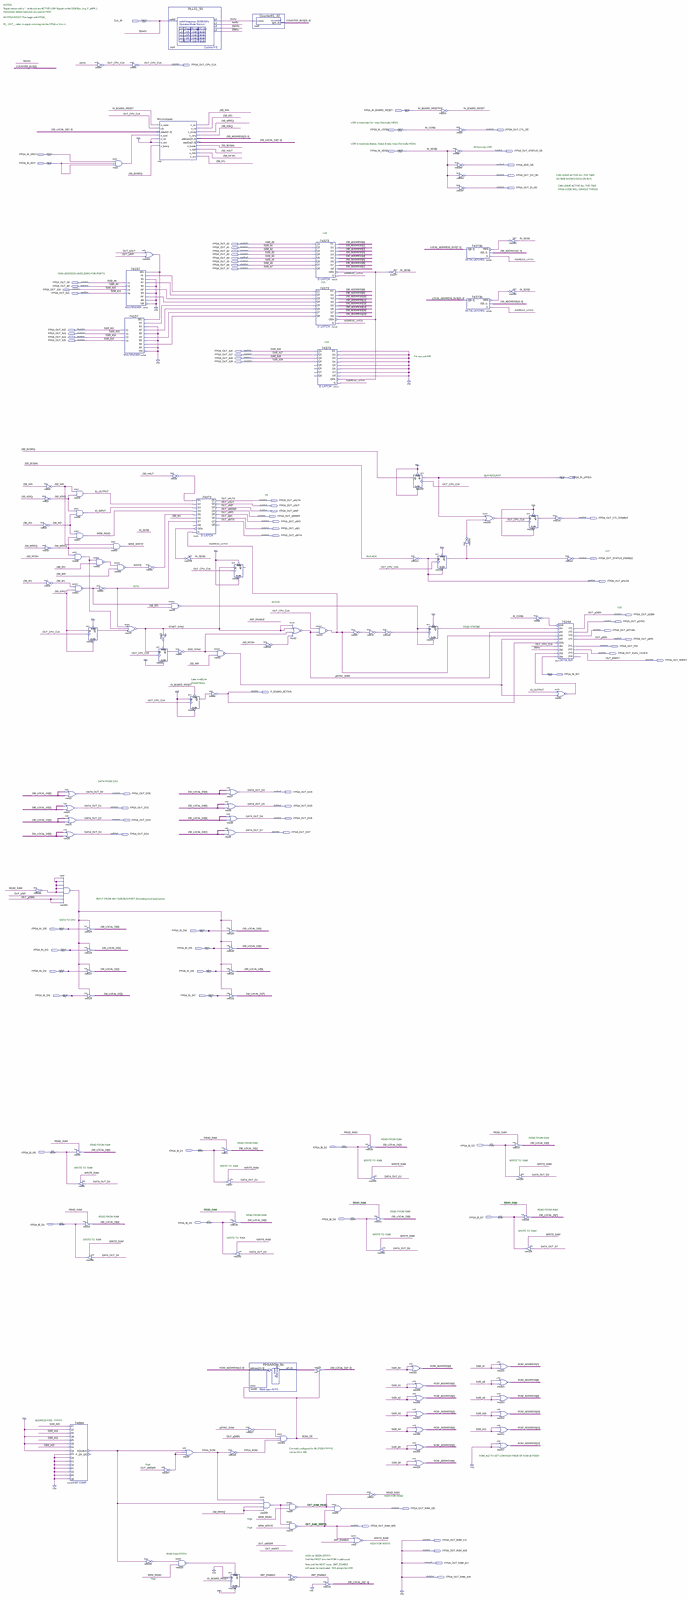
[diagram p0: schematic sheet, whole]
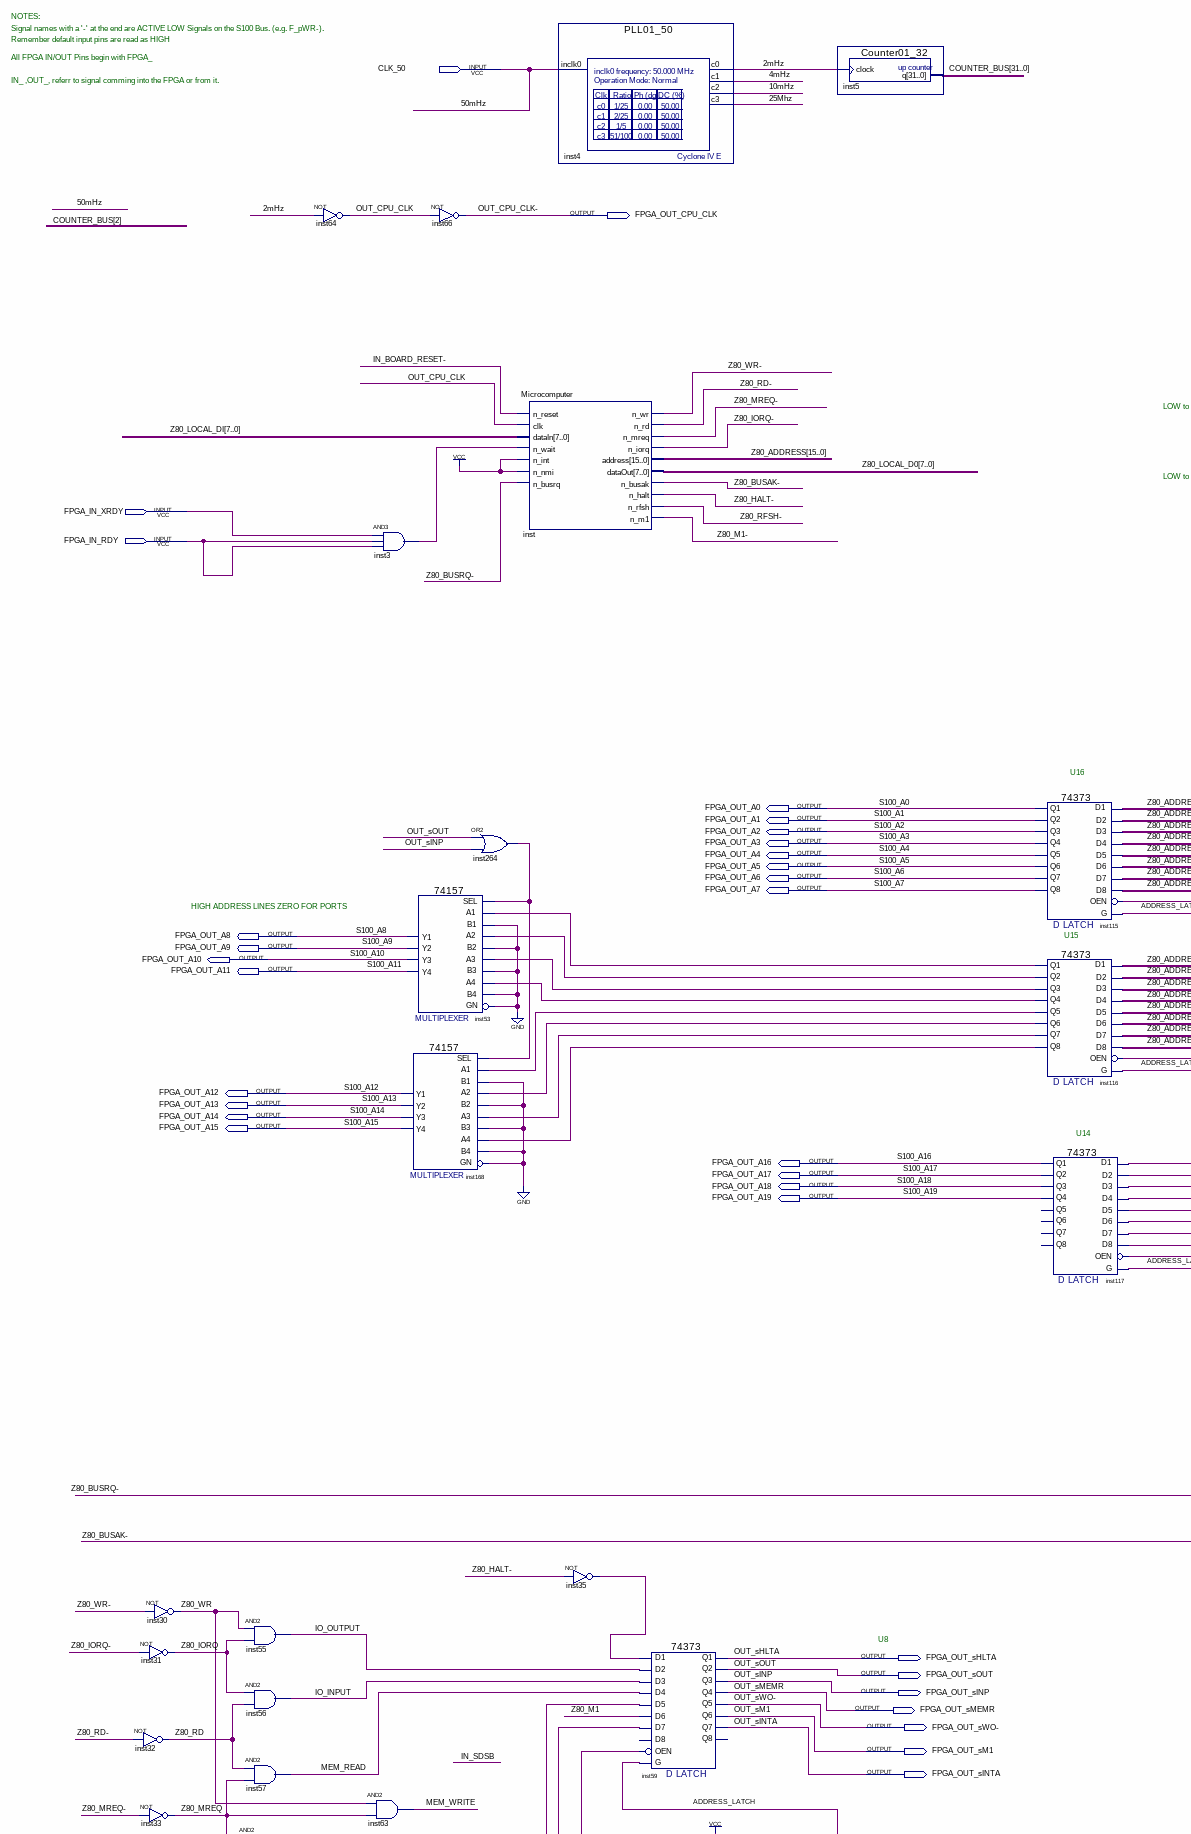
[diagram p1: schematic sheet, upper left part]
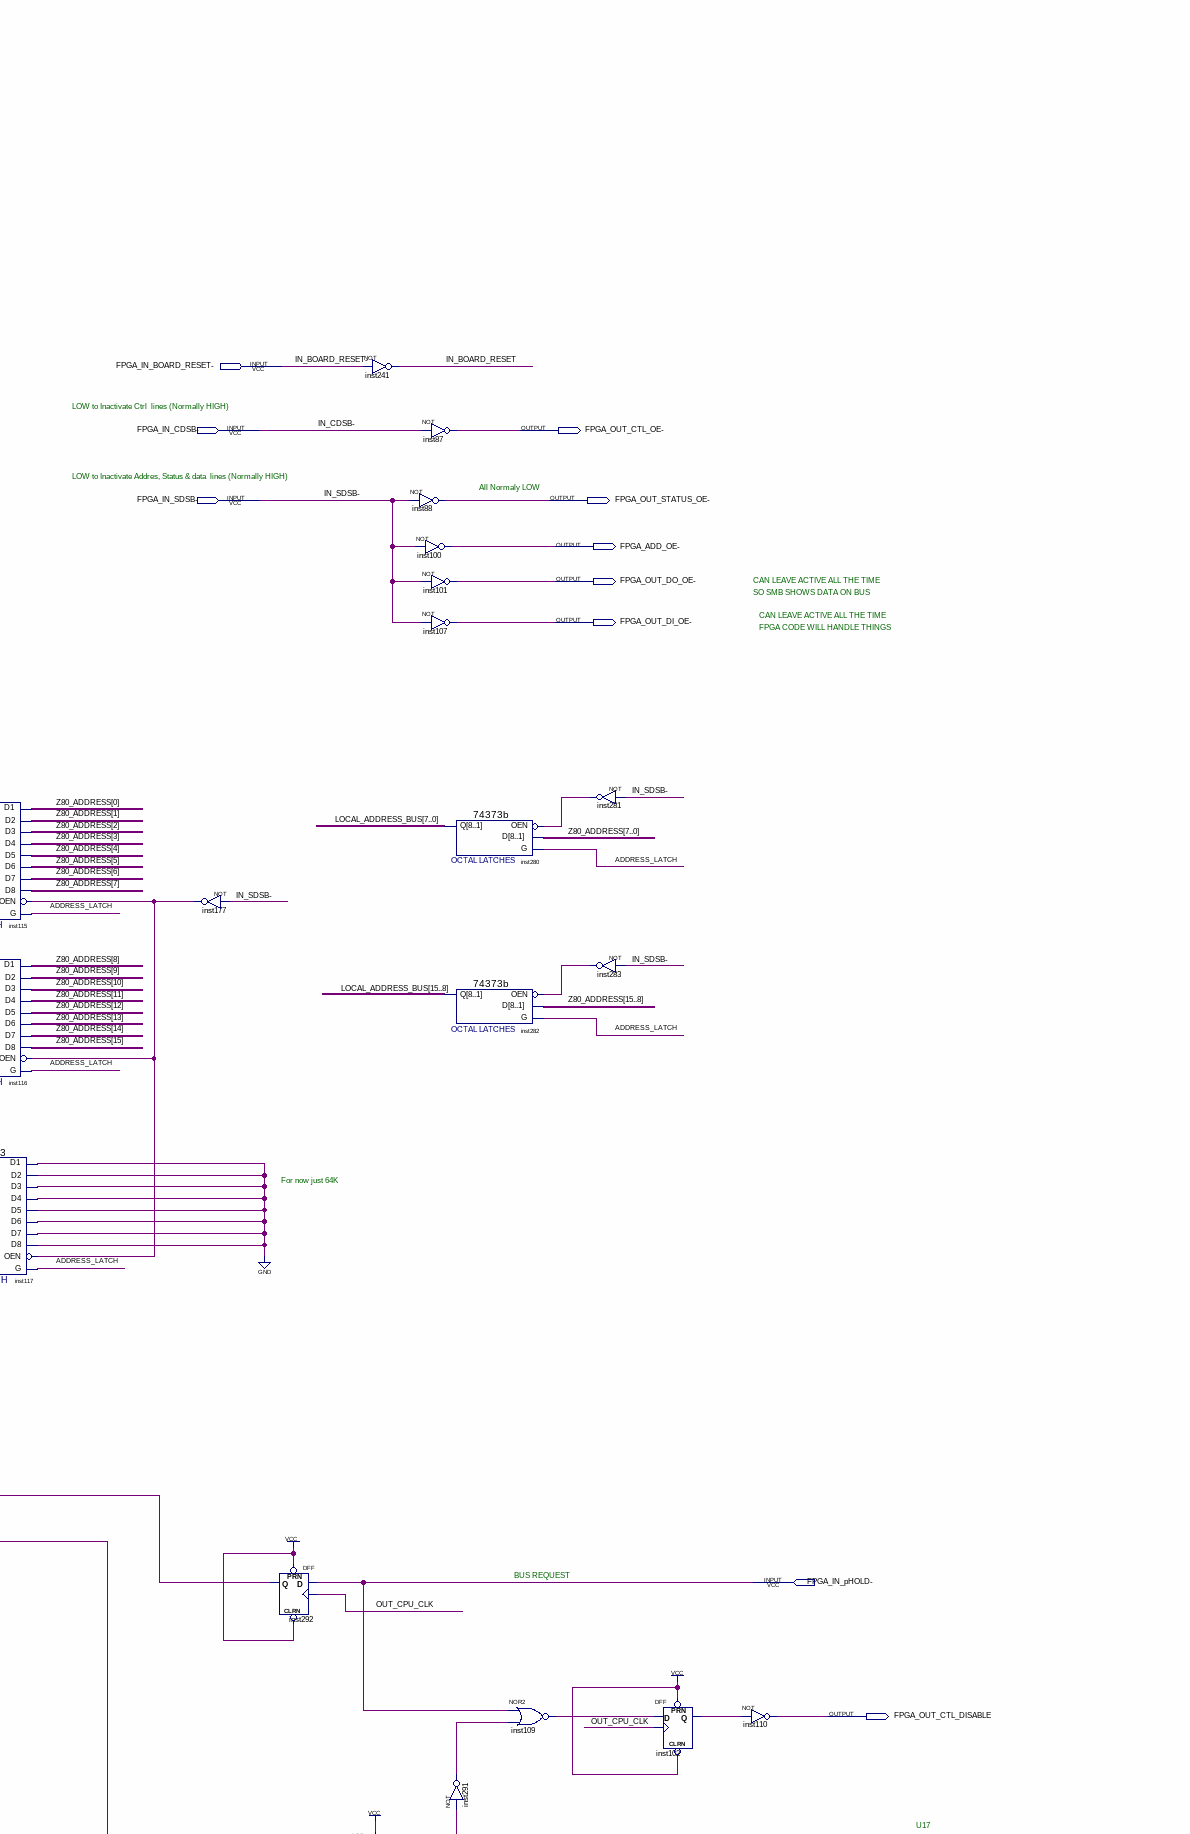
[diagram p2: schematic sheet, upper right part]
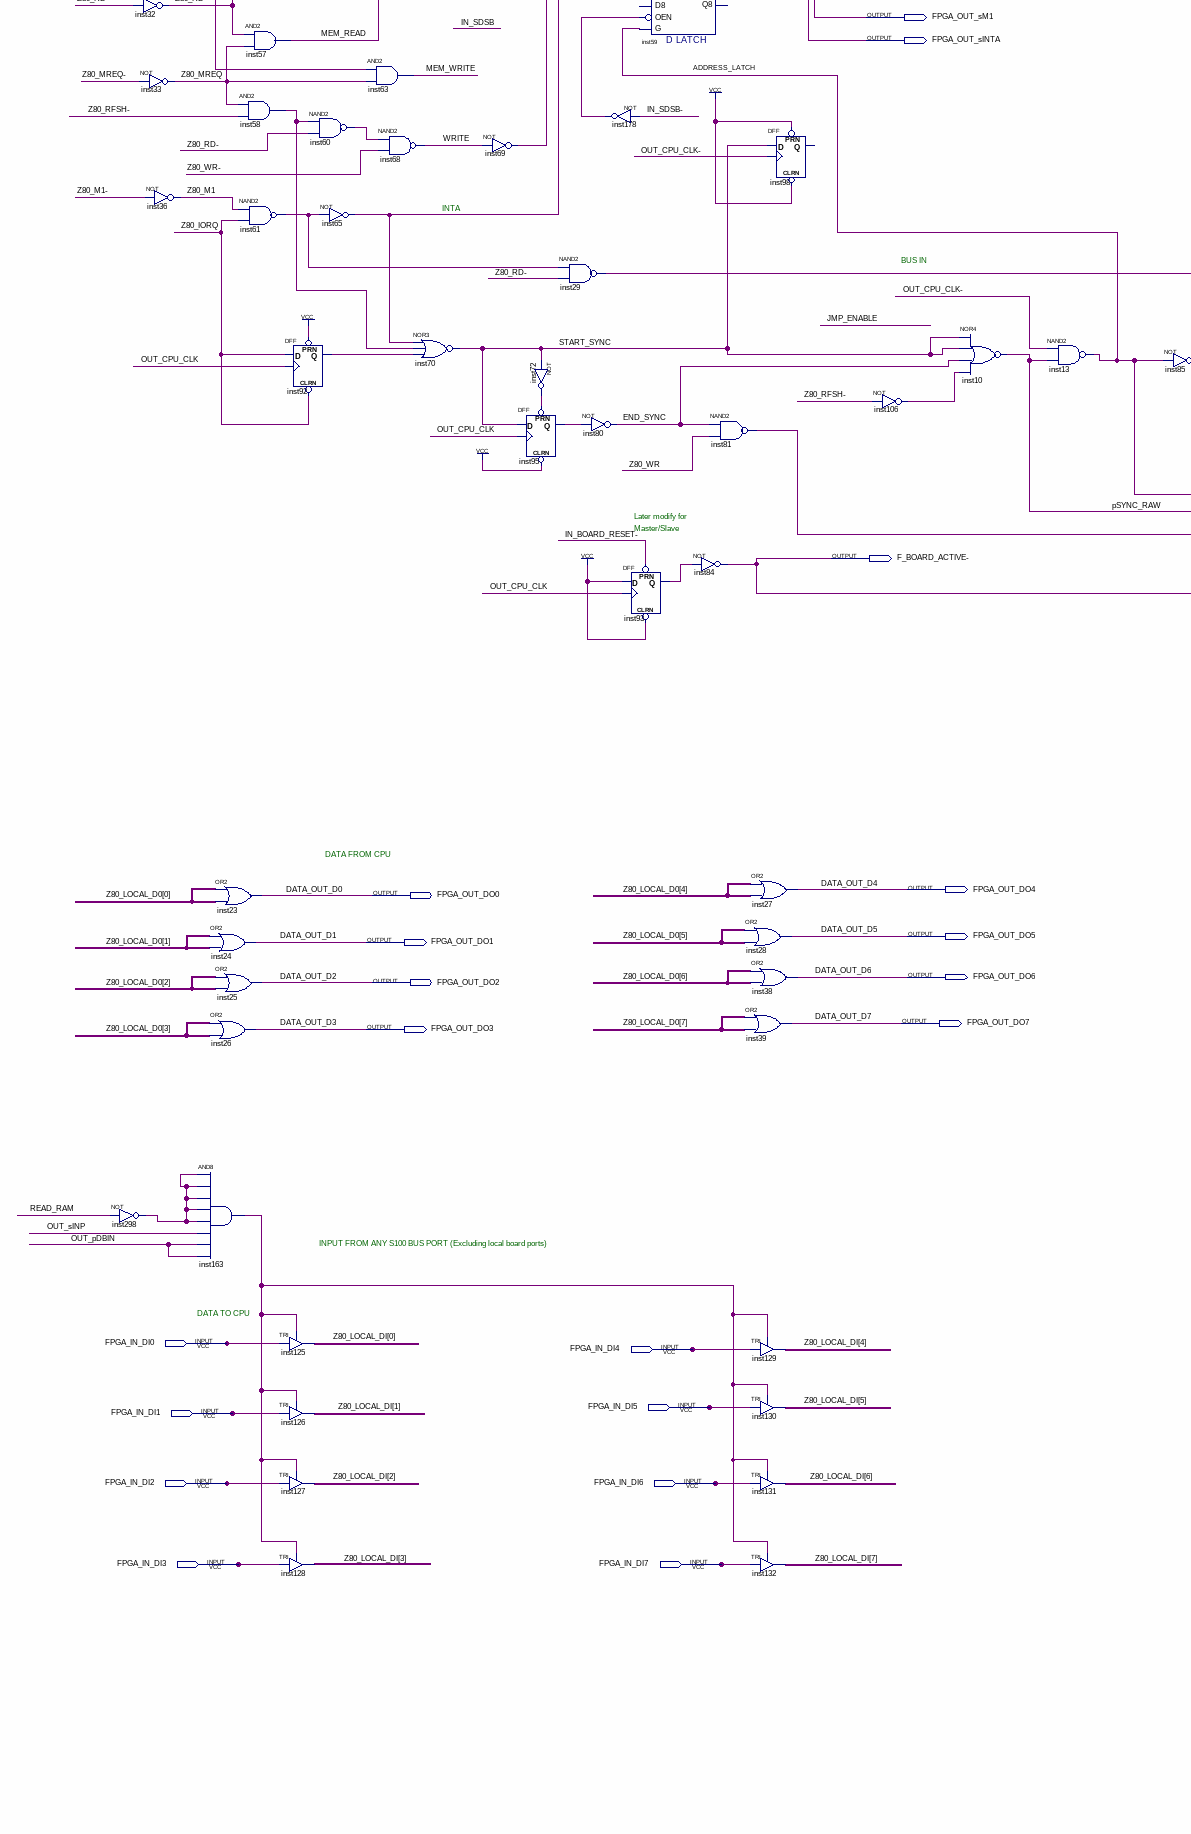
[diagram p3: schematic sheet, middle left part]
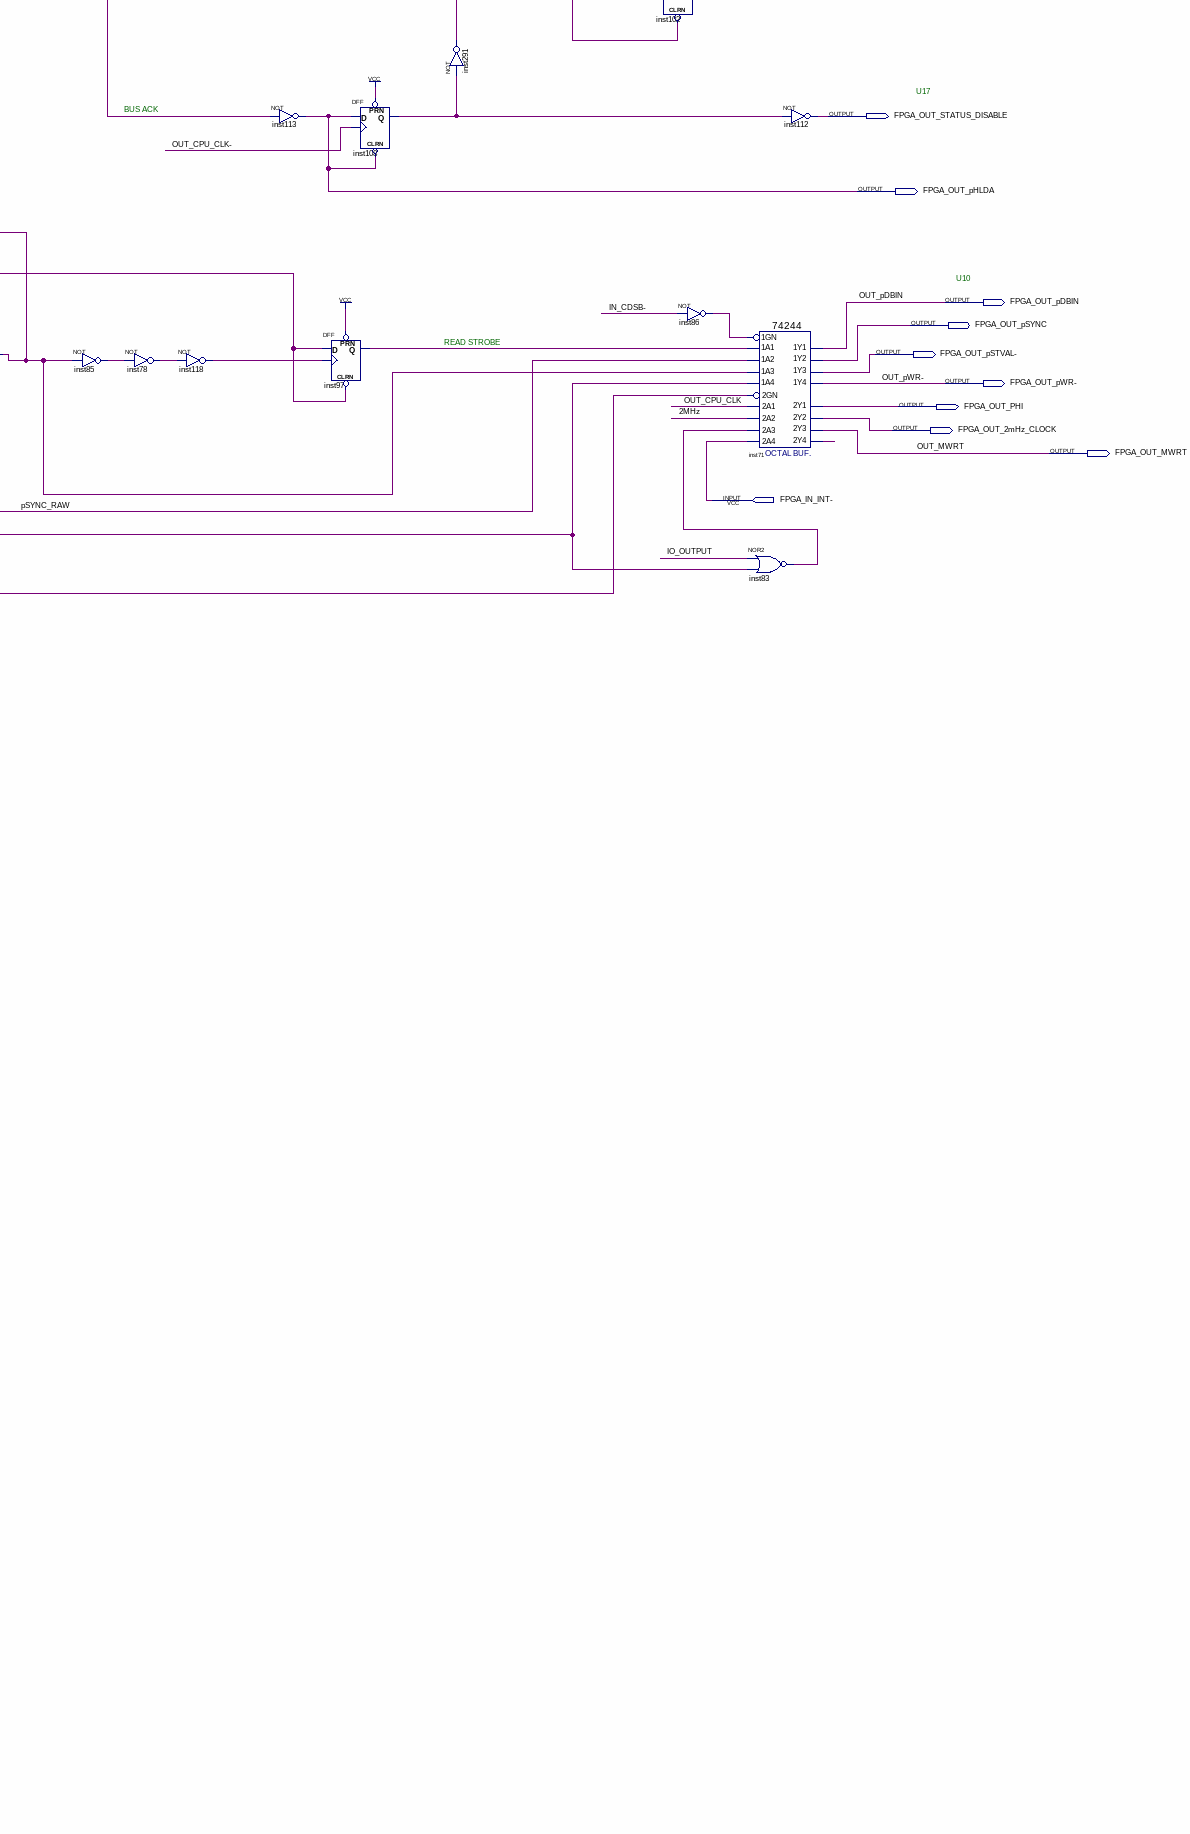
[diagram p4: schematic sheet, middle right part]
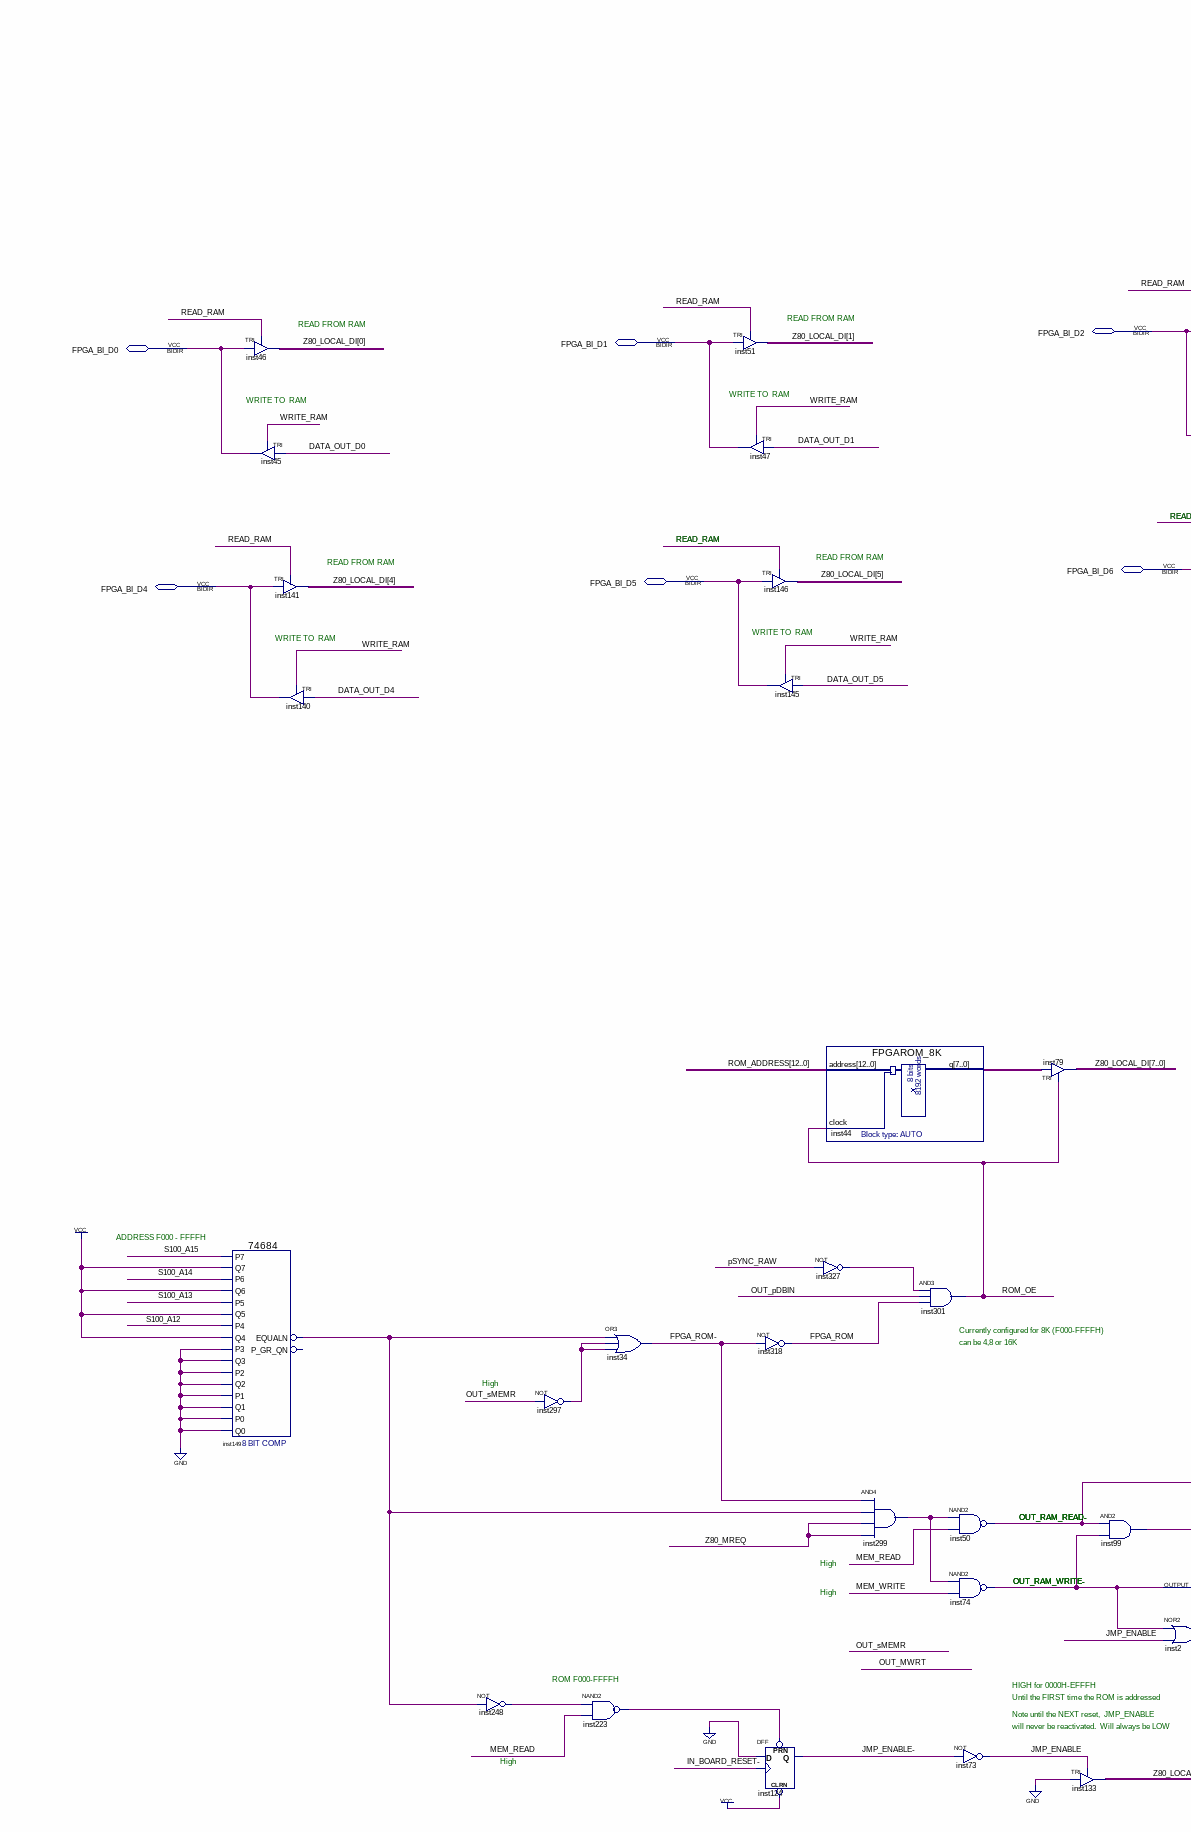
[diagram p5: schematic sheet, lower left part]
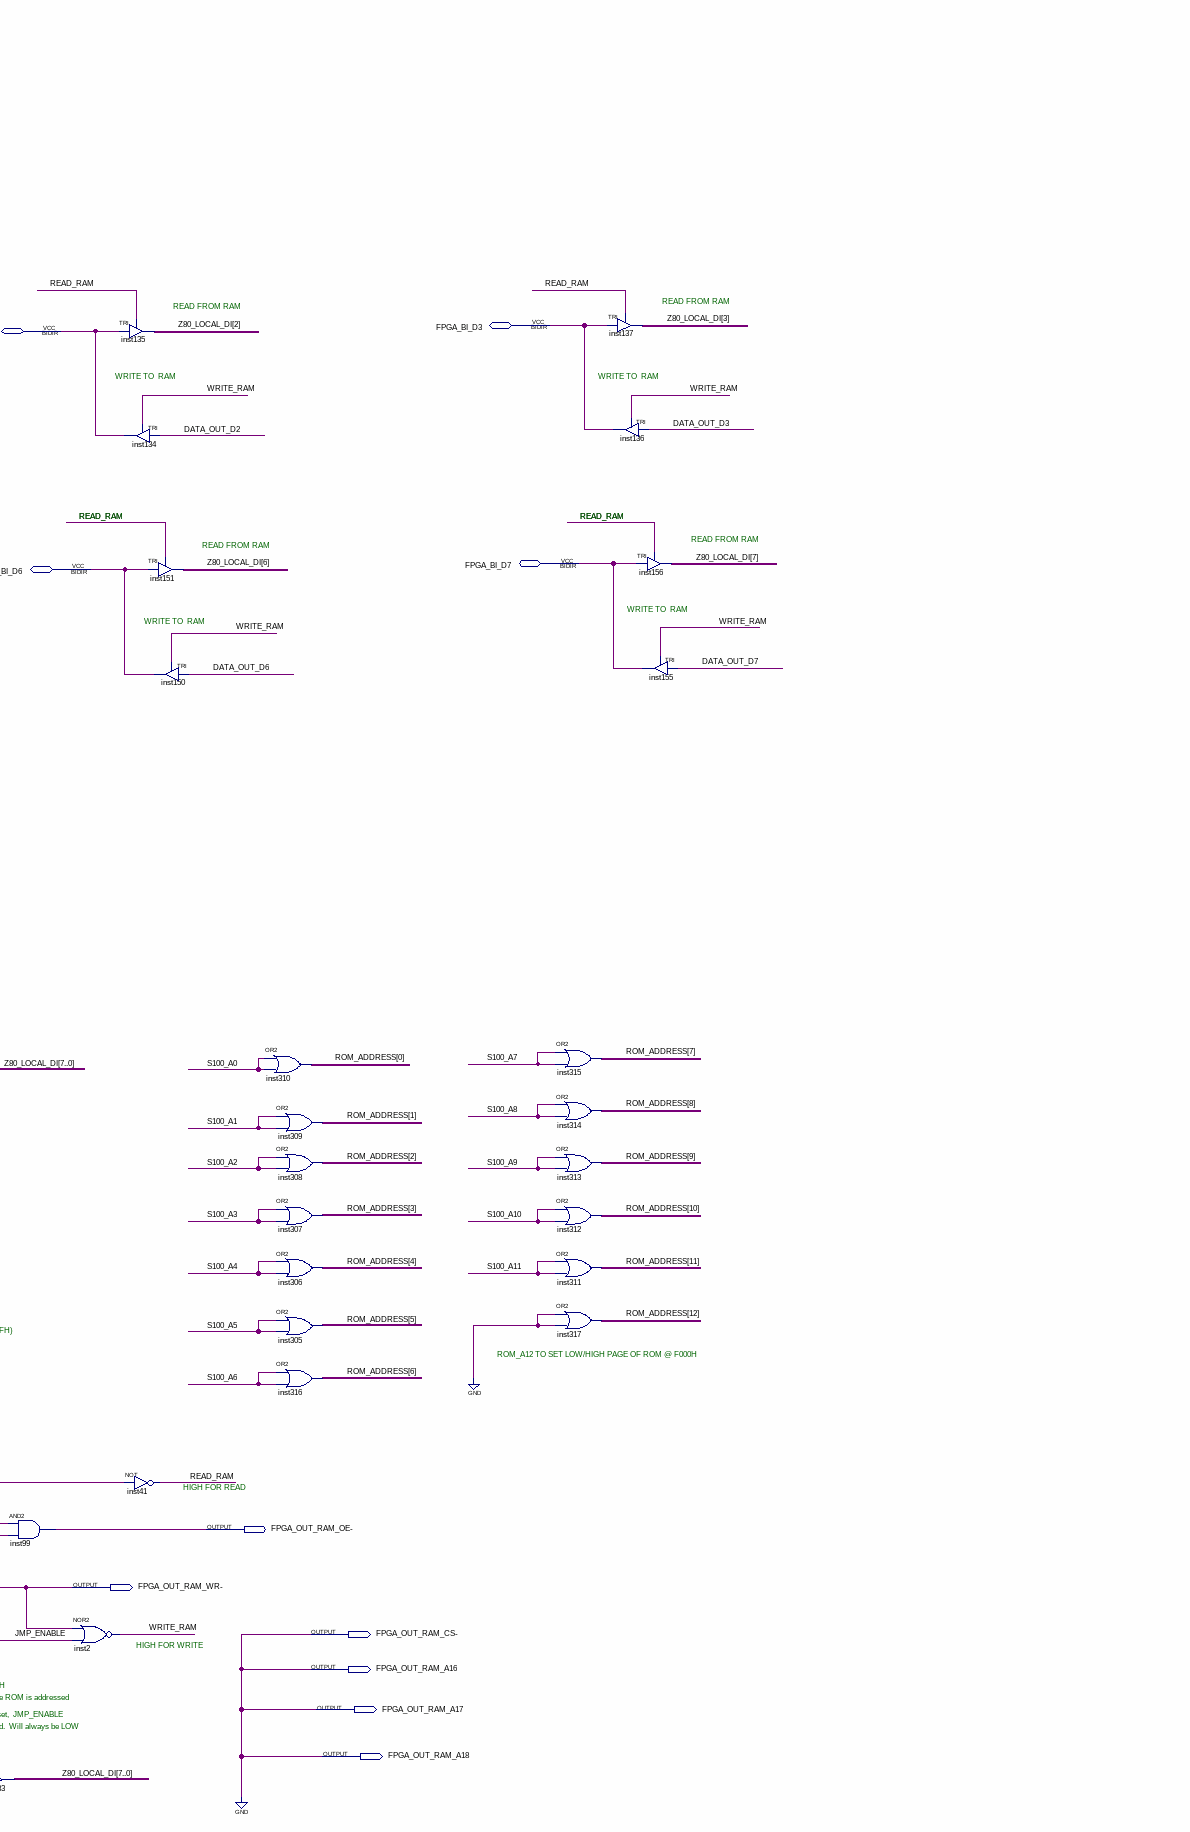
[diagram p6: schematic sheet, lower right part]
// Quartus schematic Z80_FPGA6.bdf as structural Verilog: 135 symbols, 82 pins
module Z80_FPGA6 (
  input  CLK_50,
  input  \FPGA_IN_BOARD_RESET- ,
  input  \FPGA_IN_CDSB- ,
  input  \FPGA_IN_SDSB- ,
  input  FPGA_IN_XRDY,
  input  FPGA_IN_RDY,
  input  \FPGA_IN_pHOLD- ,
  input  \FPGA_IN_INT- ,
  input  FPGA_IN_DI0,
  input  FPGA_IN_DI4,
  input  FPGA_IN_DI5,
  input  FPGA_IN_DI1,
  input  FPGA_IN_DI2,
  input  FPGA_IN_DI6,
  input  FPGA_IN_DI3,
  input  FPGA_IN_DI7,
  inout  FPGA_BI_D3,
  inout  FPGA_BI_D2,
  inout  FPGA_BI_D1,
  inout  FPGA_BI_D0,
  inout  FPGA_BI_D7,
  inout  FPGA_BI_D6,
  inout  FPGA_BI_D5,
  inout  FPGA_BI_D4,
  output FPGA_OUT_CPU_CLK,
  output \FPGA_OUT_CTL_OE- ,
  output \FPGA_OUT_STATUS_OE- ,
  output \FPGA_ADD_OE- ,
  output \FPGA_OUT_DO_OE- ,
  output \FPGA_OUT_DI_OE- ,
  output FPGA_OUT_A0,
  output FPGA_OUT_A1,
  output FPGA_OUT_A2,
  output FPGA_OUT_A3,
  output FPGA_OUT_A4,
  output FPGA_OUT_A5,
  output FPGA_OUT_A6,
  output FPGA_OUT_A7,
  output FPGA_OUT_A8,
  output FPGA_OUT_A9,
  output FPGA_OUT_A10,
  output FPGA_OUT_A11,
  output FPGA_OUT_A12,
  output FPGA_OUT_A13,
  output FPGA_OUT_A14,
  output FPGA_OUT_A15,
  output FPGA_OUT_A16,
  output FPGA_OUT_A17,
  output FPGA_OUT_A18,
  output FPGA_OUT_A19,
  output FPGA_OUT_sHLTA,
  output FPGA_OUT_sOUT,
  output FPGA_OUT_sINP,
  output FPGA_OUT_sMEMR,
  output FPGA_OUT_CTL_DISABLE,
  output \FPGA_OUT_sWO- ,
  output FPGA_OUT_sM1,
  output FPGA_OUT_sINTA,
  output FPGA_OUT_STATUS_DISABLE,
  output FPGA_OUT_pHLDA,
  output FPGA_OUT_pDBIN,
  output FPGA_OUT_pSYNC,
  output \FPGA_OUT_pSTVAL- ,
  output \FPGA_OUT_pWR- ,
  output FPGA_OUT_PHI,
  output FPGA_OUT_2mHz_CLOCK,
  output FPGA_OUT_MWRT,
  output \F_BOARD_ACTIVE- ,
  output FPGA_OUT_DO4,
  output FPGA_OUT_DO0,
  output FPGA_OUT_DO5,
  output FPGA_OUT_DO1,
  output FPGA_OUT_DO6,
  output FPGA_OUT_DO2,
  output FPGA_OUT_DO7,
  output FPGA_OUT_DO3,
  output \FPGA_OUT_RAM_OE- ,
  output \FPGA_OUT_RAM_WR- ,
  output \FPGA_OUT_RAM_CS- ,
  output FPGA_OUT_RAM_A16,
  output FPGA_OUT_RAM_A17,
  output FPGA_OUT_RAM_A18
);

  wire \2mHz , \4mHz , \10mHz , \25Mhz , ADDRESS_LATCH, END_SYNC, FPGA_ROM, \FPGA_ROM- , IN_BOARD_RESET,
       inst3_out, inst29_out, inst35_out, inst58_out, inst60_out, inst61_out, inst65_out, inst69_out,
       inst71_2y4, inst72_out, inst78_out, inst81_out, inst83_out, inst85_out, inst86_out, inst92_q,
       inst93_q, inst95_q, inst97_q, inst102_q, inst106_out, inst108_q, inst109_out, inst116_q1, inst116_q2,
       inst116_q3, inst116_q4, inst116_q5, inst116_q6, inst116_q7, inst116_q8, inst118_out, inst149_equaln,
       inst163_out, inst177_out, inst178_out, inst223_out, inst248_out, inst264_out, inst281_out,
       inst283_out, inst291_out, inst297_out, inst298_out, inst299_out, inst327_out, IO_INPUT, IO_OUTPUT,
       JMP_ENABLE, \JMP_ENABLE- , MEM_READ, MEM_WRITE, OUT_CPU_CLK, \OUT_RAM_READ- , pSYNC_RAW, READ_RAM,
       ROM_OE, START_SYNC, WRITE, WRITE_RAM, \Z80_BUSAK- , \Z80_BUSRQ- , \Z80_HALT- , Z80_IORQ, \Z80_IORQ- ,
       Z80_M1, \Z80_M1- , Z80_MREQ, \Z80_MREQ- , Z80_RD, \Z80_RD- , \Z80_RFSH- , Z80_WR, \Z80_WR- ;
  wire [7:0] inst44_q, Z80_LOCAL_D0, Z80_LOCAL_DI;
  wire [12:0] ROM_ADDRESS;
  wire [15:0] LOCAL_ADDRESS_BUS, Z80_ADDRESS;
  wire [31:0] COUNTER_BUS;

  not inst32 (Z80_RD, \Z80_RD- );
  not inst298 (inst298_out, READ_RAM);
  not inst30 (Z80_WR, \Z80_WR- );
  not inst31 (Z80_IORQ, \Z80_IORQ- );
  not inst33 (Z80_MREQ, \Z80_MREQ- );
  not inst36 (Z80_M1, \Z80_M1- );
  or inst23 (FPGA_OUT_DO0, Z80_LOCAL_D0[0], Z80_LOCAL_D0[0]);
  or inst24 (FPGA_OUT_DO1, Z80_LOCAL_D0[1], Z80_LOCAL_D0[1]);
  or inst25 (FPGA_OUT_DO2, Z80_LOCAL_D0[2], Z80_LOCAL_D0[2]);
  or inst26 (FPGA_OUT_DO3, Z80_LOCAL_D0[3], Z80_LOCAL_D0[3]);
  and inst163 (inst163_out, inst298_out, inst298_out, inst298_out, inst298_out, inst298_out, FPGA_OUT_sINP, FPGA_OUT_pDBIN, FPGA_OUT_pDBIN);
  \74684  inst149 (
    .P2(1'b0), .Q2(1'b0), .P1(1'b0), .Q1(1'b0), .P0(1'b0), .Q0(1'b0), .P7(FPGA_OUT_A15), .Q7(1'b1),
    .Q6(1'b1), .P6(FPGA_OUT_A14), .Q5(1'b1), .P5(FPGA_OUT_A13), .P4(FPGA_OUT_A12), .Q4(1'b1), .Q3(1'b0),
    .P3(1'b0), .EQUALN(inst149_equaln));  // open: P_GR_QN
  and inst55 (IO_OUTPUT, Z80_WR, Z80_IORQ);
  and inst56 (IO_INPUT, Z80_IORQ, Z80_RD);
  and inst57 (MEM_READ, Z80_RD, Z80_MREQ);
  and inst58 (inst58_out, Z80_MREQ, \Z80_RFSH- );
  nand inst61 (inst61_out, Z80_M1, Z80_IORQ);
  TRI inst46 (.IN(FPGA_BI_D0), .OE(READ_RAM), .OUT(Z80_LOCAL_DI[0]));
  TRI inst45 (.IN(FPGA_OUT_DO0), .OE(WRITE_RAM), .OUT(FPGA_BI_D0));
  TRI inst141 (.IN(FPGA_BI_D4), .OE(READ_RAM), .OUT(Z80_LOCAL_DI[4]));
  not inst64 (OUT_CPU_CLK, \2mHz );
  nand inst60 (inst60_out, inst58_out, \Z80_RD- );
  not inst65 (inst65_out, inst61_out);
  DFF inst92 (.CLRN(Z80_IORQ), .CLK(OUT_CPU_CLK), .D(Z80_IORQ), .PRN(1'b1), .Q(inst92_q));
  TRI inst125 (.IN(FPGA_IN_DI0), .OE(inst163_out), .OUT(Z80_LOCAL_DI[0]));
  TRI inst126 (.IN(FPGA_IN_DI1), .OE(inst163_out), .OUT(Z80_LOCAL_DI[1]));
  TRI inst127 (.IN(FPGA_IN_DI2), .OE(inst163_out), .OUT(Z80_LOCAL_DI[2]));
  TRI inst128 (.IN(FPGA_IN_DI3), .OE(inst163_out), .OUT(Z80_LOCAL_DI[3]));
  TRI inst140 (.IN(FPGA_OUT_DO4), .OE(WRITE_RAM), .OUT(FPGA_BI_D4));
  and inst63 (MEM_WRITE, Z80_WR, Z80_MREQ);
  and inst3 (inst3_out, FPGA_IN_XRDY, FPGA_IN_RDY, FPGA_IN_RDY);
  \74157  inst53 (
    .A1(inst116_q1), .B1(1'b0), .SEL(inst264_out), .B2(1'b0), .A3(inst116_q3), .B3(1'b0), .A2(inst116_q2),
    .B4(1'b0), .GN(1'b0), .A4(inst116_q4), .Y2(FPGA_OUT_A9), .Y1(FPGA_OUT_A8), .Y4(FPGA_OUT_A11),
    .Y3(FPGA_OUT_A10));
  \74157  inst168 (
    .A1(inst116_q5), .B1(1'b0), .SEL(inst264_out), .B2(1'b0), .A3(inst116_q7), .B3(1'b0), .A2(inst116_q6),
    .B4(1'b0), .GN(1'b0), .A4(inst116_q8), .Y2(FPGA_OUT_A13), .Y1(FPGA_OUT_A12), .Y4(FPGA_OUT_A15),
    .Y3(FPGA_OUT_A14));
  nand inst68 (WRITE, inst60_out, \Z80_WR- );
  nor inst70 (START_SYNC, inst65_out, inst58_out, inst92_q);
  not inst66 (FPGA_OUT_CPU_CLK, OUT_CPU_CLK);
  or inst264 (inst264_out, FPGA_OUT_sOUT, FPGA_OUT_sINP);
  not inst69 (inst69_out, WRITE);
  not inst248 (inst248_out, inst149_equaln);
  Microcomputer inst (
    .n_reset(\FPGA_IN_BOARD_RESET- ), .clk(OUT_CPU_CLK), .dataIn(Z80_LOCAL_DI), .n_wait(inst3_out),
    .n_int(1'b1), .n_nmi(1'b1), .n_busrq(\Z80_BUSRQ- ), .n_wr(\Z80_WR- ), .n_rd(\Z80_RD- ),
    .n_mreq(\Z80_MREQ- ), .n_iorq(\Z80_IORQ- ), .address(Z80_ADDRESS), .dataOut(Z80_LOCAL_D0),
    .n_busak(\Z80_BUSAK- ), .n_halt(\Z80_HALT- ), .n_rfsh(\Z80_RFSH- ), .n_m1(\Z80_M1- ));
  not inst72 (inst72_out, START_SYNC);
  DFF inst95 (.CLRN(1'b1), .CLK(OUT_CPU_CLK), .D(START_SYNC), .PRN(inst72_out), .Q(inst95_q));
  not inst297 (inst297_out, FPGA_OUT_sMEMR);
  PLL01_50 inst4 (.inclk0(CLK_50), .c0(\2mHz ), .c1(\4mHz ), .c2(\10mHz ), .c3(\25Mhz ));
  not inst35 (inst35_out, \Z80_HALT- );
  nand inst29 (inst29_out, inst61_out, \Z80_RD- );
  not inst80 (END_SYNC, inst95_q);
  nand inst223 (inst223_out, inst248_out, MEM_READ);
  \74373  inst59 (
    .D1(inst35_out), .D3(IO_INPUT), .D6(Z80_M1), .D7(inst65_out), .D2(IO_OUTPUT), .G(ADDRESS_LATCH),
    .D4(MEM_READ), .D5(inst69_out), .OEN(inst178_out), .Q3(FPGA_OUT_sINP), .Q6(FPGA_OUT_sM1),
    .Q7(FPGA_OUT_sINTA), .Q2(FPGA_OUT_sOUT), .Q4(FPGA_OUT_sMEMR), .Q5(\FPGA_OUT_sWO- ), .Q1(FPGA_OUT_sHLTA));  // open: D8, Q8
  not inst178 (inst178_out, \FPGA_IN_SDSB- );
  DFF inst93 (.CLRN(1'b1), .CLK(OUT_CPU_CLK), .D(1'b1), .PRN(\FPGA_IN_BOARD_RESET- ), .Q(inst93_q));
  or inst34 (\FPGA_ROM- , inst149_equaln, inst297_out, inst297_out);
  not inst84 (\F_BOARD_ACTIVE- , inst93_q);
  nand inst81 (inst81_out, END_SYNC, Z80_WR);
  TRI inst51 (.IN(FPGA_BI_D1), .OE(READ_RAM), .OUT(Z80_LOCAL_DI[1]));
  TRI inst47 (.IN(FPGA_OUT_DO1), .OE(WRITE_RAM), .OUT(FPGA_BI_D1));
  DFF inst98 (.CLRN(1'b1), .CLK(FPGA_OUT_CPU_CLK), .D(START_SYNC), .PRN(1'b1));  // open: Q
  or inst27 (FPGA_OUT_DO4, Z80_LOCAL_D0[4], Z80_LOCAL_D0[4]);
  or inst28 (FPGA_OUT_DO5, Z80_LOCAL_D0[5], Z80_LOCAL_D0[5]);
  or inst38 (FPGA_OUT_DO6, Z80_LOCAL_D0[6], Z80_LOCAL_D0[6]);
  or inst39 (FPGA_OUT_DO7, Z80_LOCAL_D0[7], Z80_LOCAL_D0[7]);
  TRI inst129 (.IN(FPGA_IN_DI4), .OE(inst163_out), .OUT(Z80_LOCAL_DI[4]));
  TRI inst130 (.IN(FPGA_IN_DI5), .OE(inst163_out), .OUT(Z80_LOCAL_DI[5]));
  TRI inst131 (.IN(FPGA_IN_DI6), .OE(inst163_out), .OUT(Z80_LOCAL_DI[6]));
  TRI inst132 (.IN(FPGA_IN_DI7), .OE(inst163_out), .OUT(Z80_LOCAL_DI[7]));
  TRI inst146 (.IN(FPGA_BI_D5), .OE(READ_RAM), .OUT(Z80_LOCAL_DI[5]));
  TRI inst145 (.IN(FPGA_OUT_DO5), .OE(WRITE_RAM), .OUT(FPGA_BI_D5));
  not inst318 (FPGA_ROM, \FPGA_ROM- );
  DFF inst124 (.CLRN(1'b1), .CLK(\FPGA_IN_BOARD_RESET- ), .D(1'b0), .PRN(inst223_out), .Q(\JMP_ENABLE- ));
  FPGAROM_8K inst44 (.address(ROM_ADDRESS), .clock(ROM_OE), .q(inst44_q));
  not inst327 (inst327_out, pSYNC_RAW);
  Counter01_32 inst5 (.clock(\2mHz ), .q(COUNTER_BUS));
  not inst106 (inst106_out, \Z80_RFSH- );
  and inst299 (inst299_out, \FPGA_ROM- , inst149_equaln, Z80_MREQ, Z80_MREQ);
  and inst301 (ROM_OE, inst327_out, FPGA_OUT_pDBIN, FPGA_ROM);
  nor inst10 (pSYNC_RAW, START_SYNC, START_SYNC, END_SYNC, inst106_out);
  nand inst50 (\OUT_RAM_READ- , inst299_out, MEM_READ);
  nand inst74 (\FPGA_OUT_RAM_WR- , inst299_out, MEM_WRITE);
  not inst73 (JMP_ENABLE, \JMP_ENABLE- );
  \74373  inst115 (
    .D1(Z80_ADDRESS[0]), .D3(Z80_ADDRESS[2]), .D6(Z80_ADDRESS[5]), .D7(Z80_ADDRESS[6]), .D2(Z80_ADDRESS[1]),
    .G(ADDRESS_LATCH), .D4(Z80_ADDRESS[3]), .D5(Z80_ADDRESS[4]), .D8(Z80_ADDRESS[7]), .OEN(inst177_out),
    .Q3(FPGA_OUT_A2), .Q6(FPGA_OUT_A5), .Q7(FPGA_OUT_A6), .Q2(FPGA_OUT_A1), .Q8(FPGA_OUT_A7),
    .Q4(FPGA_OUT_A3), .Q5(FPGA_OUT_A4), .Q1(FPGA_OUT_A0));
  \74373  inst116 (
    .D1(Z80_ADDRESS[8]), .D3(Z80_ADDRESS[10]), .D6(Z80_ADDRESS[13]), .D7(Z80_ADDRESS[14]),
    .D2(Z80_ADDRESS[9]), .G(ADDRESS_LATCH), .D4(Z80_ADDRESS[11]), .D5(Z80_ADDRESS[12]), .D8(Z80_ADDRESS[15]),
    .OEN(inst177_out), .Q3(inst116_q3), .Q6(inst116_q6), .Q7(inst116_q7), .Q2(inst116_q2), .Q8(inst116_q8),
    .Q4(inst116_q4), .Q5(inst116_q5), .Q1(inst116_q1));
  \74373  inst117 (
    .D1(1'b0), .D3(1'b0), .D6(1'b0), .D7(1'b0), .D2(1'b0), .G(ADDRESS_LATCH), .D4(1'b0), .D5(1'b0),
    .D8(1'b0), .OEN(inst177_out), .Q3(FPGA_OUT_A18), .Q2(FPGA_OUT_A17), .Q4(FPGA_OUT_A19), .Q1(FPGA_OUT_A16));  // open: Q6, Q7, Q8, Q5
  nand inst13 (ADDRESS_LATCH, FPGA_OUT_CPU_CLK, pSYNC_RAW);
  TRI inst79[7:0] (.IN(inst44_q), .OE(ROM_OE), .OUT(Z80_LOCAL_DI));
  and inst99 (\FPGA_OUT_RAM_OE- , \OUT_RAM_READ- , \FPGA_OUT_RAM_WR- );
  TRI inst133[7:0] (.IN(1'b0), .OE(JMP_ENABLE), .OUT(Z80_LOCAL_DI));
  not inst85 (inst85_out, ADDRESS_LATCH);
  nor inst2 (WRITE_RAM, \FPGA_OUT_RAM_WR- , JMP_ENABLE);
  not inst78 (inst78_out, inst85_out);
  TRI inst135 (.IN(FPGA_BI_D2), .OE(READ_RAM), .OUT(Z80_LOCAL_DI[2]));
  TRI inst134 (.IN(FPGA_OUT_DO2), .OE(WRITE_RAM), .OUT(FPGA_BI_D2));
  TRI inst151 (.IN(FPGA_BI_D6), .OE(READ_RAM), .OUT(Z80_LOCAL_DI[6]));
  TRI inst150 (.IN(FPGA_OUT_DO6), .OE(WRITE_RAM), .OUT(FPGA_BI_D6));
  not inst41 (READ_RAM, \OUT_RAM_READ- );
  not inst177 (inst177_out, \FPGA_IN_SDSB- );
  not inst118 (inst118_out, inst78_out);
  DFF inst292 (.CLRN(1'b1), .CLK(OUT_CPU_CLK), .D(\FPGA_IN_pHOLD- ), .PRN(1'b1), .Q(\Z80_BUSRQ- ));
  not inst113 (FPGA_OUT_pHLDA, \Z80_BUSAK- );
  or inst310 (ROM_ADDRESS[0], FPGA_OUT_A0, FPGA_OUT_A0);
  or inst309 (ROM_ADDRESS[1], FPGA_OUT_A1, FPGA_OUT_A1);
  or inst308 (ROM_ADDRESS[2], FPGA_OUT_A2, FPGA_OUT_A2);
  or inst307 (ROM_ADDRESS[3], FPGA_OUT_A3, FPGA_OUT_A3);
  or inst306 (ROM_ADDRESS[4], FPGA_OUT_A4, FPGA_OUT_A4);
  or inst305 (ROM_ADDRESS[5], FPGA_OUT_A5, FPGA_OUT_A5);
  or inst316 (ROM_ADDRESS[6], FPGA_OUT_A6, FPGA_OUT_A6);
  DFF inst97 (.CLRN(inst29_out), .CLK(inst118_out), .D(inst29_out), .PRN(1'b1), .Q(inst97_q));
  not inst241 (IN_BOARD_RESET, \FPGA_IN_BOARD_RESET- );
  DFF inst108 (.CLRN(FPGA_OUT_pHLDA), .CLK(FPGA_OUT_CPU_CLK), .D(FPGA_OUT_pHLDA), .PRN(1'b1), .Q(inst108_q));
  not inst87 (\FPGA_OUT_CTL_OE- , \FPGA_IN_CDSB- );
  not inst88 (\FPGA_OUT_STATUS_OE- , \FPGA_IN_SDSB- );
  not inst100 (\FPGA_ADD_OE- , \FPGA_IN_SDSB- );
  not inst101 (\FPGA_OUT_DO_OE- , \FPGA_IN_SDSB- );
  not inst107 (\FPGA_OUT_DI_OE- , \FPGA_IN_SDSB- );
  \74373b  inst280 (.D(Z80_ADDRESS[7:0]), .G(ADDRESS_LATCH), .OEN(inst281_out), .Q(LOCAL_ADDRESS_BUS[7:0]));
  \74373b  inst282 (.D(Z80_ADDRESS[15:8]), .G(ADDRESS_LATCH), .OEN(inst283_out), .Q(LOCAL_ADDRESS_BUS[15:8]));
  not inst291 (inst291_out, inst108_q);
  nor inst109 (inst109_out, \FPGA_IN_pHOLD- , inst291_out);
  or inst315 (ROM_ADDRESS[7], FPGA_OUT_A7, FPGA_OUT_A7);
  or inst314 (ROM_ADDRESS[8], FPGA_OUT_A8, FPGA_OUT_A8);
  or inst313 (ROM_ADDRESS[9], FPGA_OUT_A9, FPGA_OUT_A9);
  or inst312 (ROM_ADDRESS[10], FPGA_OUT_A10, FPGA_OUT_A10);
  or inst311 (ROM_ADDRESS[11], FPGA_OUT_A11, FPGA_OUT_A11);
  or inst317 (ROM_ADDRESS[12], 1'b0, 1'b0);
  not inst281 (inst281_out, \FPGA_IN_SDSB- );
  not inst283 (inst283_out, \FPGA_IN_SDSB- );
  TRI inst137 (.IN(FPGA_BI_D3), .OE(READ_RAM), .OUT(Z80_LOCAL_DI[3]));
  TRI inst136 (.IN(FPGA_OUT_DO3), .OE(WRITE_RAM), .OUT(FPGA_BI_D3));
  DFF inst102 (.CLRN(1'b1), .CLK(OUT_CPU_CLK), .D(inst109_out), .PRN(1'b1), .Q(inst102_q));
  TRI inst156 (.IN(FPGA_BI_D7), .OE(READ_RAM), .OUT(Z80_LOCAL_DI[7]));
  TRI inst155 (.IN(FPGA_OUT_DO7), .OE(WRITE_RAM), .OUT(FPGA_BI_D7));
  not inst86 (inst86_out, \FPGA_IN_CDSB- );
  not inst110 (FPGA_OUT_CTL_DISABLE, inst102_q);
  \74244  inst71 (
    .\1A2 (pSYNC_RAW), .\1A4 (inst81_out), .\1A1 (inst97_q), .\1A3 (ADDRESS_LATCH), .\1GN (inst86_out),
    .\2A3 (inst83_out), .\2GN (\F_BOARD_ACTIVE- ), .\2A1 (OUT_CPU_CLK), .\2A4 (\FPGA_IN_INT- ),
    .\2A2 (\2mHz ), .\1Y2 (FPGA_OUT_pSYNC), .\1Y4 (\FPGA_OUT_pWR- ), .\2Y1 (FPGA_OUT_PHI),
    .\1Y1 (FPGA_OUT_pDBIN), .\2Y3 (FPGA_OUT_MWRT), .\2Y4 (inst71_2y4), .\1Y3 (\FPGA_OUT_pSTVAL- ),
    .\2Y2 (FPGA_OUT_2mHz_CLOCK));
  nor inst83 (inst83_out, IO_OUTPUT, inst81_out);
  not inst112 (FPGA_OUT_STATUS_DISABLE, inst108_q);

  assign FPGA_OUT_RAM_A16 = 1'b0;
  assign FPGA_OUT_RAM_A17 = 1'b0;
  assign FPGA_OUT_RAM_A18 = 1'b0;
  assign \FPGA_OUT_RAM_CS-  = 1'b0;

  // Other names for the same wires on the sheet: 50mHz = CLK_50; DATA_OUT_D0 = FPGA_OUT_DO0;
  //   DATA_OUT_D1 = FPGA_OUT_DO1; DATA_OUT_D2 = FPGA_OUT_DO2; DATA_OUT_D3 = FPGA_OUT_DO3; DATA_OUT_D4 = FPGA_OUT_DO4;
  //   DATA_OUT_D5 = FPGA_OUT_DO5; DATA_OUT_D6 = FPGA_OUT_DO6; DATA_OUT_D7 = FPGA_OUT_DO7; OUT_sINP = FPGA_OUT_sINP;
  //   OUT_sMEMR = FPGA_OUT_sMEMR; OUT_sOUT = FPGA_OUT_sOUT; OUT_sWO- = \FPGA_OUT_sWO- ;
  //   IN_BOARD_RESET- = \FPGA_IN_BOARD_RESET- ; IN_CDSB- = \FPGA_IN_CDSB- ; IN_SDSB- = \FPGA_IN_SDSB- ;
  //   OUT_CPU_CLK- = FPGA_OUT_CPU_CLK; OUT_MWRT = FPGA_OUT_MWRT; OUT_pDBIN = FPGA_OUT_pDBIN;
  //   OUT_pWR- = \FPGA_OUT_pWR- ; OUT_RAM_WRITE- = \FPGA_OUT_RAM_WR- ; OUT_sHLTA = FPGA_OUT_sHLTA;
  //   OUT_sINTA = FPGA_OUT_sINTA; OUT_sM1 = FPGA_OUT_sM1; S100_A0 = FPGA_OUT_A0; S100_A1 = FPGA_OUT_A1;
  //   S100_A2 = FPGA_OUT_A2; S100_A3 = FPGA_OUT_A3; S100_A4 = FPGA_OUT_A4; S100_A5 = FPGA_OUT_A5;
  //   S100_A6 = FPGA_OUT_A6; S100_A7 = FPGA_OUT_A7; S100_A8 = FPGA_OUT_A8; S100_A9 = FPGA_OUT_A9;
  //   S100_A10 = FPGA_OUT_A10; S100_A11 = FPGA_OUT_A11; S100_A12 = FPGA_OUT_A12; S100_A13 = FPGA_OUT_A13;
  //   S100_A14 = FPGA_OUT_A14; S100_A15 = FPGA_OUT_A15; S100_A16 = FPGA_OUT_A16; S100_A17 = FPGA_OUT_A17;
  //   S100_A18 = FPGA_OUT_A18; S100_A19 = FPGA_OUT_A19

  // Notes on the sheet:
  //   NOTES:
  //   Signal names with a '-' at the end are ACTIVE LOW Signals on the S100 Bus. (e.g. F_pWR-).
  //   Remember default input pins are read as HIGH
  //   All FPGA IN/OUT Pins begin with FPGA_
  //   IN_ ,OUT_, referr to signal comming into the FPGA or from it.
  //   LOW to Inactivate Ctrl  lines (Normally HIGH)
  //   LOW to Inactivate Addres, Status & data  lines (Normally HIGH)
  //   All Normaly LOW
  //   CAN LEAVE ACTIVE ALL THE TIME
  //   SO SMB SHOWS DATA ON BUS
  //   CAN LEAVE ACTIVE ALL THE TIME
  //   FPGA CODE WILL HANDLE THINGS
  //   U16
  //   HIGH ADDRESS LINES ZERO FOR PORTS
  //   U15
  //   U14
  //   For now just 64K
  //   BUS REQUEST
  //   U8
  //   U17
  //   BUS ACK
  //   INTA
  //   BUS IN
  //   U10
  //   READ STROBE
  //   Later modify for
  //   Master/Slave
  //   DATA FROM CPU
  //   INPUT FROM ANY S100 BUS PORT (Excluding local board ports)
  //   DATA TO CPU
  //    READ FROM RAM
  //    READ FROM RAM
  //    READ FROM RAM
  //    READ FROM RAM
  //    WRITE TO  RAM
  //    WRITE TO  RAM
  //    WRITE TO  RAM
  //    WRITE TO  RAM
  //   READ_RAM
  //   READ_RAM
  //   READ_RAM
  //    READ FROM RAM
  //    READ FROM RAM
  //    READ FROM RAM
  //    READ FROM RAM
  //    WRITE TO  RAM
  //    WRITE TO  RAM
  //    WRITE TO  RAM
  //    WRITE TO  RAM
  //   ADDRESS F000 - FFFFH
  //   Currently configured for 8K (F000-FFFFH)
  //   can be 4,8 or 16K
  //   ROM_A12 TO SET LOW/HIGH PAGE OF ROM @ F000H
  //   High
  //   HIGH FOR READ
  //   OUT_RAM_READ-
  //   OUT_RAM_READ-
  //   High
  //   OUT_RAM_WRITE-
  //   OUT_RAM_WRITE-
  //   High
  //   HIGH FOR WRITE
  //   ROM F000-FFFFH
  //   HIGH for 0000H-EFFFH
  //   Until the FIRST time the ROM is addressed
  //   Note until the NEXT reset,  JMP_ENABLE 
  //   will never be reactivated.  Will always be LOW
  //   High
endmodule
